# Altium schematic sheet STM32F407VG_Sch.SchDoc
size A4
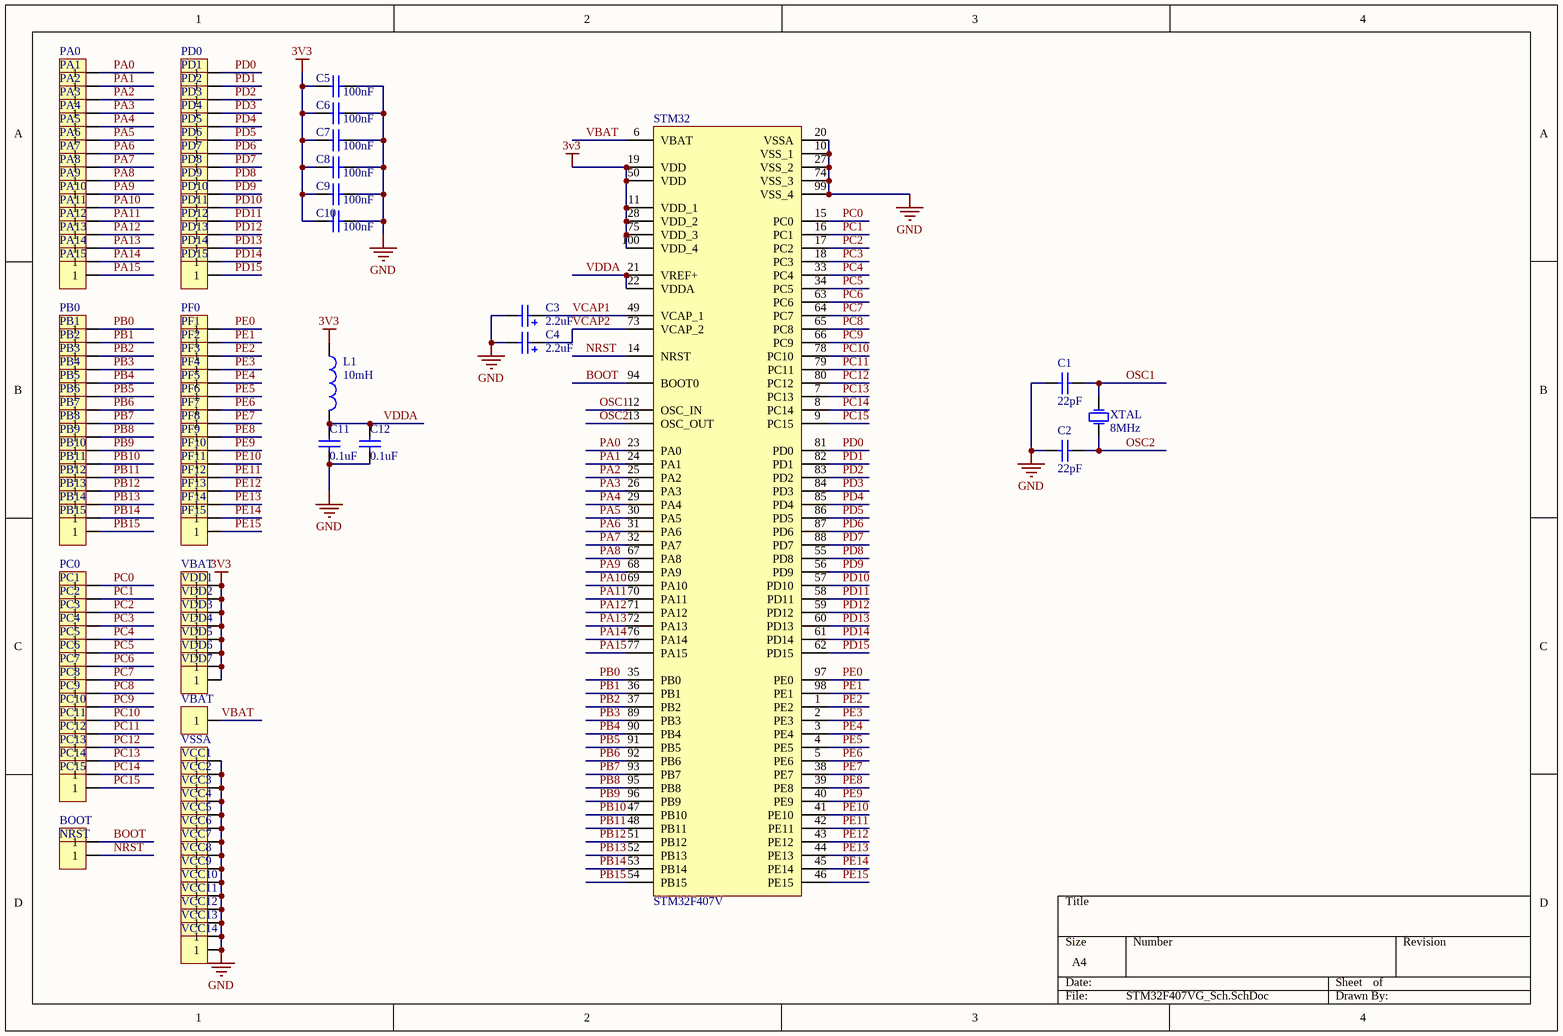
[diagram p0: STM32F407VG_Sch.SchDoc]

## Parts
(Parts that share a designator on the sheet are numbered #1, #2 ... from top to bottom, then left to right.)
BOOT  Header 1  [HDR1X1]  (value not drawn)
C1  value 22pF  [0603]  (hidden comment: Cap)
C2  value 22pF  [0603]  (hidden comment: Cap)
C3  2.2uf  [0805]
C4  2.2uf  [0805]
C5  value 100nF  [0603]  (hidden comment: Cap)
C6  value 100nF  [0603]  (hidden comment: Cap)
C7  value 100nF  [0603]  (hidden comment: Cap)
C8  value 100nF  [0603]  (hidden comment: Cap)
C9  value 100nF  [0603]  (hidden comment: Cap)
C10  value 100nF  [0603]  (hidden comment: Cap)
C11  value 0.1uF  [0603]  (hidden comment: Cap)
C12  value 0.1uF  [0603]  (hidden comment: Cap)
L1  value 10mH  [0603]  (hidden comment: Inductor)
NRST  Header 1  [HDR1X1]  (value not drawn)
PA0  Header 1  [HDR1X1]  (value not drawn)
PA1  Header 1  [HDR1X1]  (value not drawn)
PA2  Header 1  [HDR1X1]  (value not drawn)
PA3  Header 1  [HDR1X1]  (value not drawn)
PA4  Header 1  [HDR1X1]  (value not drawn)
PA5  Header 1  [HDR1X1]  (value not drawn)
PA6  Header 1  [HDR1X1]  (value not drawn)
PA7  Header 1  [HDR1X1]  (value not drawn)
PA8  Header 1  [HDR1X1]  (value not drawn)
PA9  Header 1  [HDR1X1]  (value not drawn)
PA10  Header 1  [HDR1X1]  (value not drawn)
PA11  Header 1  [HDR1X1]  (value not drawn)
PA12  Header 1  [HDR1X1]  (value not drawn)
PA13  Header 1  [HDR1X1]  (value not drawn)
PA14  Header 1  [HDR1X1]  (value not drawn)
PA15  Header 1  [HDR1X1]  (value not drawn)
PB0  Header 1  [HDR1X1]  (value not drawn)
PB1  Header 1  [HDR1X1]  (value not drawn)
PB2  Header 1  [HDR1X1]  (value not drawn)
PB3  Header 1  [HDR1X1]  (value not drawn)
PB4  Header 1  [HDR1X1]  (value not drawn)
PB5  Header 1  [HDR1X1]  (value not drawn)
PB6  Header 1  [HDR1X1]  (value not drawn)
PB7  Header 1  [HDR1X1]  (value not drawn)
PB8  Header 1  [HDR1X1]  (value not drawn)
PB9  Header 1  [HDR1X1]  (value not drawn)
PB10  Header 1  [HDR1X1]  (value not drawn)
PB11  Header 1  [HDR1X1]  (value not drawn)
PB12  Header 1  [HDR1X1]  (value not drawn)
PB13  Header 1  [HDR1X1]  (value not drawn)
PB14  Header 1  [HDR1X1]  (value not drawn)
PB15  Header 1  [HDR1X1]  (value not drawn)
PC0  Header 1  [HDR1X1]  (value not drawn)
PC1  Header 1  [HDR1X1]  (value not drawn)
PC2  Header 1  [HDR1X1]  (value not drawn)
PC3  Header 1  [HDR1X1]  (value not drawn)
PC4  Header 1  [HDR1X1]  (value not drawn)
PC5  Header 1  [HDR1X1]  (value not drawn)
PC6  Header 1  [HDR1X1]  (value not drawn)
PC7  Header 1  [HDR1X1]  (value not drawn)
PC8  Header 1  [HDR1X1]  (value not drawn)
PC9  Header 1  [HDR1X1]  (value not drawn)
PC10  Header 1  [HDR1X1]  (value not drawn)
PC11  Header 1  [HDR1X1]  (value not drawn)
PC12  Header 1  [HDR1X1]  (value not drawn)
PC13  Header 1  [HDR1X1]  (value not drawn)
PC14  Header 1  [HDR1X1]  (value not drawn)
PC15  Header 1  [HDR1X1]  (value not drawn)
PD0  Header 1  [HDR1X1]  (value not drawn)
PD1  Header 1  [HDR1X1]  (value not drawn)
PD2  Header 1  [HDR1X1]  (value not drawn)
PD3  Header 1  [HDR1X1]  (value not drawn)
PD4  Header 1  [HDR1X1]  (value not drawn)
PD5  Header 1  [HDR1X1]  (value not drawn)
PD6  Header 1  [HDR1X1]  (value not drawn)
PD7  Header 1  [HDR1X1]  (value not drawn)
PD8  Header 1  [HDR1X1]  (value not drawn)
PD9  Header 1  [HDR1X1]  (value not drawn)
PD10  Header 1  [HDR1X1]  (value not drawn)
PD11  Header 1  [HDR1X1]  (value not drawn)
PD12  Header 1  [HDR1X1]  (value not drawn)
PD13  Header 1  [HDR1X1]  (value not drawn)
PD14  Header 1  [HDR1X1]  (value not drawn)
PD15  Header 1  [HDR1X1]  (value not drawn)
PF0  Header 1  [HDR1X1]  (value not drawn)
PF1  Header 1  [HDR1X1]  (value not drawn)
PF2  Header 1  [HDR1X1]  (value not drawn)
PF3  Header 1  [HDR1X1]  (value not drawn)
PF4  Header 1  [HDR1X1]  (value not drawn)
PF5  Header 1  [HDR1X1]  (value not drawn)
PF6  Header 1  [HDR1X1]  (value not drawn)
PF7  Header 1  [HDR1X1]  (value not drawn)
PF8  Header 1  [HDR1X1]  (value not drawn)
PF9  Header 1  [HDR1X1]  (value not drawn)
PF10  Header 1  [HDR1X1]  (value not drawn)
PF11  Header 1  [HDR1X1]  (value not drawn)
PF12  Header 1  [HDR1X1]  (value not drawn)
PF13  Header 1  [HDR1X1]  (value not drawn)
PF14  Header 1  [HDR1X1]  (value not drawn)
PF15  Header 1  [HDR1X1]  (value not drawn)
STM32  STM32F407V  [STM32F_100]
VBAT#1  Header 1  [HDR1X1]  (value not drawn)
VBAT#2  Header 1  [HDR1X1]  (value not drawn)
VCC1  Header 1  [HDR1X1]  (value not drawn)
VCC2  Header 1  [HDR1X1]  (value not drawn)
VCC3  Header 1  [HDR1X1]  (value not drawn)
VCC4  Header 1  [HDR1X1]  (value not drawn)
VCC5  Header 1  [HDR1X1]  (value not drawn)
VCC6  Header 1  [HDR1X1]  (value not drawn)
VCC7  Header 1  [HDR1X1]  (value not drawn)
VCC8  Header 1  [HDR1X1]  (value not drawn)
VCC9  Header 1  [HDR1X1]  (value not drawn)
VCC10  Header 1  [HDR1X1]  (value not drawn)
VCC11  Header 1  [HDR1X1]  (value not drawn)
VCC12  Header 1  [HDR1X1]  (value not drawn)
VCC13  Header 1  [HDR1X1]  (value not drawn)
VCC14  Header 1  [HDR1X1]  (value not drawn)
VDD1  Header 1  [HDR1X1]  (value not drawn)
VDD2  Header 1  [HDR1X1]  (value not drawn)
VDD3  Header 1  [HDR1X1]  (value not drawn)
VDD4  Header 1  [HDR1X1]  (value not drawn)
VDD5  Header 1  [HDR1X1]  (value not drawn)
VDD6  Header 1  [HDR1X1]  (value not drawn)
VDD7  Header 1  [HDR1X1]  (value not drawn)
VSSA  Header 1  [HDR1X1]  (value not drawn)
XTAL  CLK: 8MHz  [XTAL_5032]  (hidden comment: XTAL)

## Nets
3V3: C5.1 C6.1 C7.1 C8.1 C9.1 C10.1 L1.1 STM32.11(VDD_1) STM32.19(VDD) STM32.28(VDD_2) STM32.50(VDD) STM32.75(VDD_3) STM32.100(VDD_4) VBAT#1.1 VDD1.1 VDD2.1 VDD3.1 VDD4.1 VDD5.1 VDD6.1 VDD7.1
GND: C1.1 C2.2 C3.2 C4.2 C5.2 C6.2 C7.2 C8.2 C9.2 C10.2 C11.1 C12.1 STM32.10(VSS_1) STM32.20(VSSA) STM32.27(VSS_2) STM32.74(VSS_3) STM32.99(VSS_4) VCC1.1 VCC2.1 VCC3.1 VCC4.1 VCC5.1 VCC6.1 VCC7.1 VCC8.1 VCC9.1 VCC10.1 VCC11.1 VCC12.1 VCC13.1 VCC14.1 VSSA.1
BOOT: BOOT.1 STM32.94(BOOT0)
NRST: NRST.1 STM32.14(NRST)
OSC1: C1.2 STM32.12(OSC_IN) XTAL.1(OSC1)
OSC2: C2.1 STM32.13(OSC_OUT) XTAL.2(OSC2)
PA0: PA0.1 STM32.23(PA0)
PA1: PA1.1 STM32.24(PA1)
PA2: PA2.1 STM32.25(PA2)
PA3: PA3.1 STM32.26(PA3)
PA4: PA4.1 STM32.29(PA4)
PA5: PA5.1 STM32.30(PA5)
PA6: PA6.1 STM32.31(PA6)
PA7: PA7.1 STM32.32(PA7)
PA8: PA8.1 STM32.67(PA8)
PA9: PA9.1 STM32.68(PA9)
PA10: PA10.1 STM32.69(PA10)
PA11: PA11.1 STM32.70(PA11)
PA12: PA12.1 STM32.71(PA12)
PA13: PA13.1 STM32.72(PA13)
PA14: PA14.1 STM32.76(PA14)
PA15: PA15.1 STM32.77(PA15)
PB0: PB0.1 STM32.35(PB0)
PB1: PB1.1 STM32.36(PB1)
PB2: PB2.1 STM32.37(PB2)
PB3: PB3.1 STM32.89(PB3)
PB4: PB4.1 STM32.90(PB4)
PB5: PB5.1 STM32.91(PB5)
PB6: PB6.1 STM32.92(PB6)
PB7: PB7.1 STM32.93(PB7)
PB8: PB8.1 STM32.95(PB8)
PB9: PB9.1 STM32.96(PB9)
PB10: PB10.1 STM32.47(PB10)
PB11: PB11.1 STM32.48(PB11)
PB12: PB12.1 STM32.51(PB12)
PB13: PB13.1 STM32.52(PB13)
PB14: PB14.1 STM32.53(PB14)
PB15: PB15.1 STM32.54(PB15)
PC0: PC0.1 STM32.15(PC0)
PC1: PC1.1 STM32.16(PC1)
PC2: PC2.1 STM32.17(PC2)
PC3: PC3.1 STM32.18(PC3)
PC4: PC4.1 STM32.33(PC4)
PC5: PC5.1 STM32.34(PC5)
PC6: PC6.1 STM32.63(PC6)
PC7: PC7.1 STM32.64(PC7)
PC8: PC8.1 STM32.65(PC8)
PC9: PC9.1 STM32.66(PC9)
PC10: PC10.1 STM32.78(PC10)
PC11: PC11.1 STM32.79(PC11)
PC12: PC12.1 STM32.80(PC12)
PC13: PC13.1 STM32.7(PC13)
PC14: PC14.1 STM32.8(PC14)
PC15: PC15.1 STM32.9(PC15)
PD0: PD0.1 STM32.81(PD0)
PD1: PD1.1 STM32.82(PD1)
PD2: PD2.1 STM32.83(PD2)
PD3: PD3.1 STM32.84(PD3)
PD4: PD4.1 STM32.85(PD4)
PD5: PD5.1 STM32.86(PD5)
PD6: PD6.1 STM32.87(PD6)
PD7: PD7.1 STM32.88(PD7)
PD8: PD8.1 STM32.55(PD8)
PD9: PD9.1 STM32.56(PD9)
PD10: PD10.1 STM32.57(PD10)
PD11: PD11.1 STM32.58(PD11)
PD12: PD12.1 STM32.59(PD12)
PD13: PD13.1 STM32.60(PD13)
PD14: PD14.1 STM32.61(PD14)
PD15: PD15.1 STM32.62(PD15)
PE0: PF0.1 STM32.97(PE0)
PE1: PF1.1 STM32.98(PE1)
PE2: PF2.1 STM32.1(PE2)
PE3: PF3.1 STM32.2(PE3)
PE4: PF4.1 STM32.3(PE4)
PE5: PF5.1 STM32.4(PE5)
PE6: PF6.1 STM32.5(PE6)
PE7: PF7.1 STM32.38(PE7)
PE8: PF8.1 STM32.39(PE8)
PE9: PF9.1 STM32.40(PE9)
PE10: PF10.1 STM32.41(PE10)
PE11: PF11.1 STM32.42(PE11)
PE12: PF12.1 STM32.43(PE12)
PE13: PF13.1 STM32.44(PE13)
PE14: PF14.1 STM32.45(PE14)
PE15: PF15.1 STM32.46(PE15)
VBAT: STM32.6(VBAT) VBAT#2.1
VCAP1: C3.1 STM32.49(VCAP_1)
VCAP2: C4.1 STM32.73(VCAP_2)
VDDA: C11.2 C12.2 L1.2 STM32.21(VREF+) STM32.22(VDDA)

## Library data of the parts
BOOT NRST PA0-PA15 PB0-PB15 PC0-PC15 PD0-PD15 PF0-PF15 VBAT#1 VBAT#2 VCC1-VCC14 VDD1-VDD7 VSSA = Header 1: Header, 1-Pin; LatestRevisionDate: 17-Jul-2002; LatestRevisionNote: Re-released for DXP Platform.; Publisher: Altium Limited
C1 C2 C5-C12 = Cap: Capacitor; Published: 8-Jun-2000; LatestRevisionDate: 17-Jul-2002; LatestRevisionNote: Re-released for DXP Platform.; PackageReference: RAD-0.3; Publisher: Altium Limited; PackageDescription: Radial Cap, Thru-Hole; 2 Leads; 0.3 in Pin Spacing
C3 C4 = Cap Pol2: Polarized Capacitor (Axial); Published: 8-Jun-2000; LatestRevisionDate: 17-Jul-2002; LatestRevisionNote: Re-released for DXP Platform.; PackageReference: POLAR0.8; Publisher: Altium Limited; PackageDescription: Polarized Capacitor; 2 Leads; Value: 2.2uF
L1 = Inductor: Code_IEC: 1005; Published: 8-Jun-2000; LatestRevisionDate: 29-May-2009; LatestRevisionNote: IPC-7351 Footprint Added.; PackageReference: 0402-A; Publisher: Altium Limited; PackageDescription: Chip Inductor; Code_JEITA: 0402
STM32 = STM32F407V: MCU
XTAL = XTAL: Crystal; Published: 8-Jun-2000; LatestRevisionDate: 17-Jul-2002; LatestRevisionNote: Re-released for DXP Platform.; PackageReference: R38; Publisher: Altium Limited; PackageDescription: Crystal, Thru-Hole; 2 Leads; Body 3.1 x 8.2 mm (Dia.xH)